# EAGLE design decoder_bard (EAGLE 9.3.2)
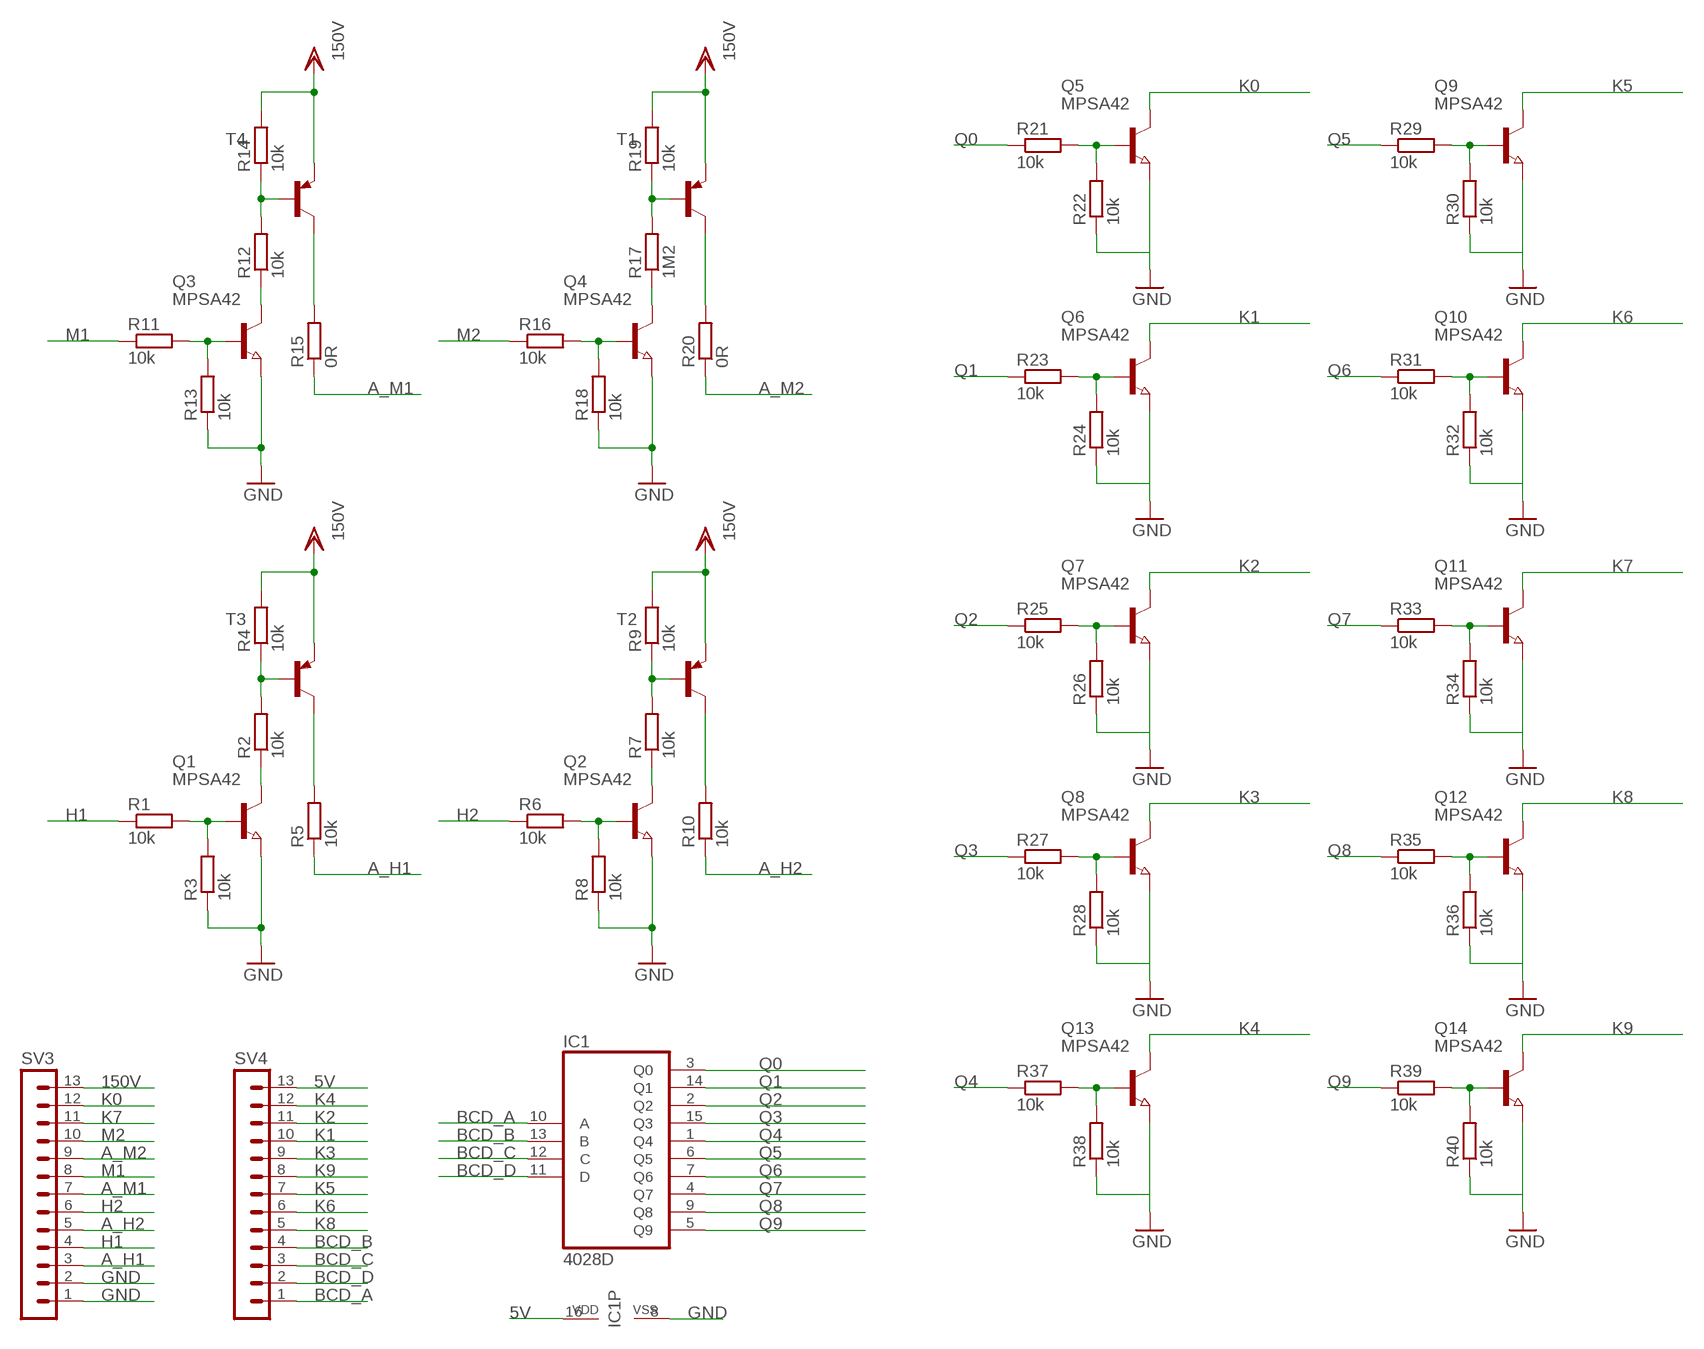
[diagram p0: schematic, sheet 1]

## Parts
IC1  4028D  [SO16]
Q1  MPSA42  NPN-TRANSISTOR_SOT23  [SOT23]
Q2  MPSA42  NPN-TRANSISTOR_SOT23  [SOT23]
Q3  MPSA42  NPN-TRANSISTOR_SOT23  [SOT23]
Q4  MPSA42  NPN-TRANSISTOR_SOT23  [SOT23]
Q5  MPSA42  NPN-TRANSISTOR_SOT23  [SOT23]
Q6  MPSA42  NPN-TRANSISTOR_SOT23  [SOT23]
Q7  MPSA42  NPN-TRANSISTOR_SOT23  [SOT23]
Q8  MPSA42  NPN-TRANSISTOR_SOT23  [SOT23]
Q9  MPSA42  NPN-TRANSISTOR_SOT23  [SOT23]
Q10  MPSA42  NPN-TRANSISTOR_SOT23  [SOT23]
Q11  MPSA42  NPN-TRANSISTOR_SOT23  [SOT23]
Q12  MPSA42  NPN-TRANSISTOR_SOT23  [SOT23]
Q13  MPSA42  NPN-TRANSISTOR_SOT23  [SOT23]
Q14  MPSA42  NPN-TRANSISTOR_SOT23  [SOT23]
R1  10k  R-EU_R1206  [R1206]
R2  10k  R-EU_R1206  [R1206]
R3  10k  R-EU_R1206  [R1206]
R4  10k  R-EU_R1206  [R1206]
R5  10k  R-EU_R1206  [R1206]
R6  10k  R-EU_R1206  [R1206]
R7  10k  R-EU_R1206  [R1206]
R8  10k  R-EU_R1206  [R1206]
R9  10k  R-EU_R1206  [R1206]
R10  10k  R-EU_R1206  [R1206]
R11  10k  R-EU_R1206  [R1206]
R12  10k  R-EU_R1206  [R1206]
R13  10k  R-EU_R1206  [R1206]
R14  10k  R-EU_R1206  [R1206]
R15  0R  R-EU_R1206  [R1206]
R16  10k  R-EU_R1206  [R1206]
R17  1M2  R-EU_R1206  [R1206]
R18  10k  R-EU_R1206  [R1206]
R19  10k  R-EU_R1206  [R1206]
R20  0R  R-EU_R1206  [R1206]
R21  10k  R-EU_R1206  [R1206]
R22  10k  R-EU_R1206  [R1206]
R23  10k  R-EU_R1206  [R1206]
R24  10k  R-EU_R1206  [R1206]
R25  10k  R-EU_R1206  [R1206]
R26  10k  R-EU_R1206  [R1206]
R27  10k  R-EU_R1206  [R1206]
R28  10k  R-EU_R1206  [R1206]
R29  10k  R-EU_R1206  [R1206]
R30  10k  R-EU_R1206  [R1206]
R31  10k  R-EU_R1206  [R1206]
R32  10k  R-EU_R1206  [R1206]
R33  10k  R-EU_R1206  [R1206]
R34  10k  R-EU_R1206  [R1206]
R35  10k  R-EU_R1206  [R1206]
R36  10k  R-EU_R1206  [R1206]
R37  10k  R-EU_R1206  [R1206]
R38  10k  R-EU_R1206  [R1206]
R39  10k  R-EU_R1206  [R1206]
R40  10k  R-EU_R1206  [R1206]
SV3  MA13-1  [MA13-1]
SV4  MA13-1  [MA13-1]
T1  MMBTA92LT1-PNP-SOT23-BEC  [SOT23-BEC]
T2  MMBTA92LT1-PNP-SOT23-BEC  [SOT23-BEC]
T3  MMBTA92LT1-PNP-SOT23-BEC  [SOT23-BEC]
T4  MMBTA92LT1-PNP-SOT23-BEC  [SOT23-BEC]

## Nets
5V: IC1.16(VDD) SV4.13
150V: R4.2 R9.2 R14.2 R19.2 SV3.13 T1.E T2.E T3.E T4.E
A_H1: R5.1 SV3.3
A_H2: R10.1 SV3.5
A_M1: R15.1 SV3.7
A_M2: R20.1 SV3.9
BCD_A: IC1.10(A) SV4.1
BCD_B: IC1.13(B) SV4.4
BCD_C: IC1.12(C) SV4.3
BCD_D: IC1.11(D) SV4.2
GND: IC1.8(VSS) Q1.2(E) Q2.2(E) Q3.2(E) Q4.2(E) Q5.2(E) Q6.2(E) Q7.2(E) Q8.2(E) Q9.2(E) Q10.2(E) Q11.2(E) Q12.2(E) Q13.2(E) Q14.2(E) R3.1 R8.1 R13.1 R18.1 R22.1 R24.1 R26.1 R28.1 R30.1 R32.1 R34.1 R36.1 R38.1 R40.1 SV3.1 SV3.2
H1: R1.1 SV3.4
H2: R6.1 SV3.6
K0: Q5.3(C) SV3.12
K1: Q6.3(C) SV4.10
K2: Q7.3(C) SV4.11
K3: Q8.3(C) SV4.9
K4: Q13.3(C) SV4.12
K5: Q9.3(C) SV4.7
K6: Q10.3(C) SV4.6
K7: Q11.3(C) SV3.11
K8: Q12.3(C) SV4.5
K9: Q14.3(C) SV4.8
M1: R11.1 SV3.8
M2: R16.1 SV3.10
N$2: Q1.1(B) R1.2 R3.2
N$4: Q1.3(C) R2.1
N$5: R5.2 T3.C
N$7: R2.2 R4.1 T3.B
N$8: Q2.1(B) R6.2 R8.2
N$9: Q2.3(C) R7.1
N$10: R10.2 T2.C
N$12: R7.2 R9.1 T2.B
N$14: Q3.1(B) R11.2 R13.2
N$15: Q3.3(C) R12.1
N$16: R15.2 T4.C
N$18: R12.2 R14.1 T4.B
N$20: Q4.1(B) R16.2 R18.2
N$21: Q4.3(C) R17.1
N$22: R20.2 T1.C
N$24: R17.2 R19.1 T1.B
N$25: Q5.1(B) R21.2 R22.2
N$28: Q6.1(B) R23.2 R24.2
N$31: Q7.1(B) R25.2 R26.2
N$34: Q8.1(B) R27.2 R28.2
N$37: Q9.1(B) R29.2 R30.2
N$40: Q10.1(B) R31.2 R32.2
N$43: Q11.1(B) R33.2 R34.2
N$46: Q12.1(B) R35.2 R36.2
N$49: Q13.1(B) R37.2 R38.2
N$52: Q14.1(B) R39.2 R40.2
Q0: IC1.3(Q0) R21.1
Q1: IC1.14(Q1) R23.1
Q2: IC1.2(Q2) R25.1
Q3: IC1.15(Q3) R27.1
Q4: IC1.1(Q4) R37.1
Q5: IC1.6(Q5) R29.1
Q6: IC1.7(Q6) R31.1
Q7: IC1.4(Q7) R33.1
Q8: IC1.9(Q8) R35.1
Q9: IC1.5(Q9) R39.1

## Library data of the parts
IC1 = 40xx:4028: BCD to decimal DECODER
Q1-Q14 = semicon-smd-ipc:NPN-TRANSISTOR_: NPN TRANSISTOR
R1-R40 = rcl:R-EU_: RESISTOR, European symbol; SPICEPREFIX: R
SV3 SV4 = con-lstb:MA13-1: PIN HEADER; OC_FARNELL: unknown; OC_NEWARK: unknown
T1-T4 = transistor:*-PNP-: PNP Transistror

## Board
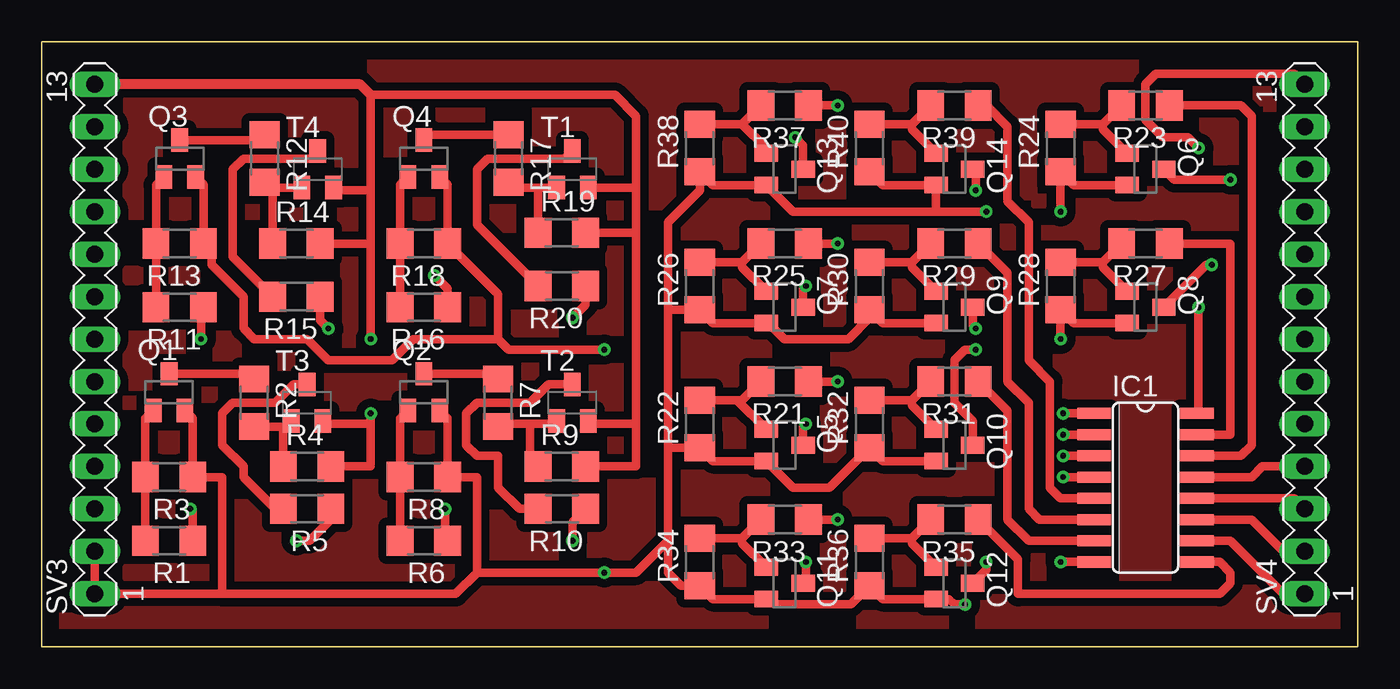
[diagram p1: board, top side]
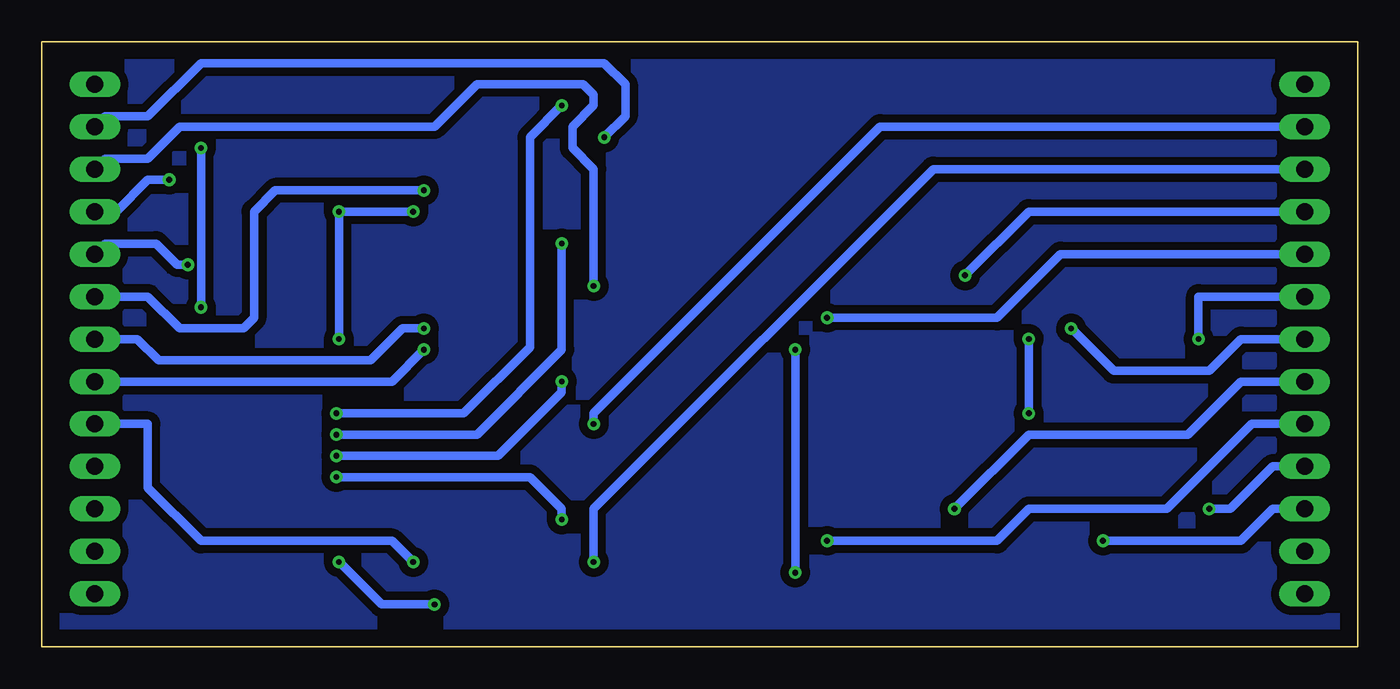
[diagram p2: board, bottom side, seen from below]

Size 78.74 x 36.2 mm. Coordinates in mm from the lower left corner, seen from the top.
Outline: 0,36.2 78.74,36.2 78.74,0 0,0 0,36.2
Copper layers (1*16): Top 0.035mm / dielectric 1.5mm / Bottom 0.035mm
Design rules "default": minimum track width 6mil, minimum drill 0.35mm, track to track 6mil, track to pad 6mil, pad to pad 6mil, via to via 6mil, smd to smd 6mil, copper to edge 40mil, drill to drill 6mil, minimum pad ring 10mil, minimum via ring 8mil, stop-mask expansion 4mil, vias tented up to drill 0mil, thermal gap 10mil

### Footprints (pad centres in the part's own frame; a part is rotated, then mirrored left to right if it is on the bottom)
SO16 = smd 0.66 x 2.032: 1 -4.445,-3.073; 2 -3.175,-3.073; 3 -1.905,-3.073; 4 -0.635,-3.073; 5 0.635,-3.073; 6 1.905,-3.073; 7 3.175,-3.073; 8 4.445,-3.073; 9 4.445,3.073; 10 3.175,3.073; 11 1.905,3.073; 12 0.635,3.073; 13 -0.635,3.073; 14 -1.905,3.073; 15 -3.175,3.073; 16 -4.445,3.073
SOT23 = smd 1 x 1.4: 1 -0.95,-1.1; 2 0.95,-1.1; 3 0,1.1
R1206 = smd 1.6 x 1.803: 1 -1.422,0; 2 1.422,0
MA13-1 = drill 1.016 long: 1 -15.24,0; 2 -12.7,0; 3 -10.16,0; 4 -7.62,0; 5 -5.08,0; 6 -2.54,0; 7 0,0; 8 2.54,0; 9 5.08,0; 10 7.62,0; 11 10.16,0; 12 12.7,0; 13 15.24,0
SOT23-BEC = smd 1 x 1.4: B -0.95,-1.1; C 0,1.1; E 0.95,-1.1

### Placement (x,y rotation side)
IC1  66.04,9.53 270 top
Q1  7.62,15.24 0 top
Q2  22.86,15.24 0 top
Q3  8.26,29.21 0 top
Q4  22.86,29.21 0 top
Q5  44.45,12.06 270 top
Q6  66.04,28.57 270 top
Q7  44.45,20.32 270 top
Q8  66.04,20.32 270 top
Q9  54.61,20.32 270 top
Q10  54.61,12.06 270 top
Q11  44.45,3.81 270 top
Q12  54.61,3.81 270 top
Q13  44.45,28.57 270 top
Q14  54.61,28.57 270 top
R1  7.62,6.35 180 top
R2  12.7,14.61 270 top
R3  7.62,10.16 180 top
R4  15.88,10.79 0 top
R5  15.88,8.26 180 top
R6  22.86,6.35 180 top
R7  27.3,14.61 270 top
R8  22.86,10.16 180 top
R9  31.11,10.79 0 top
R10  31.11,8.26 180 top
R11  8.26,20.32 180 top
R12  13.34,29.21 270 top
R13  8.26,24.13 180 top
R14  15.24,24.13 0 top
R15  15.24,20.95 180 top
R16  22.86,20.32 180 top
R17  27.94,29.21 270 top
R18  22.86,24.13 180 top
R19  31.11,24.77 0 top
R20  31.11,21.59 180 top
R21  44.45,15.88 180 top
R22  39.37,13.34 90 top
R23  66.04,32.38 180 top
R24  60.96,29.84 90 top
R25  44.45,24.13 180 top
R26  39.37,21.59 90 top
R27  66.04,24.13 180 top
R28  60.96,21.59 90 top
R29  54.61,24.13 180 top
R30  49.53,21.59 90 top
R31  54.61,15.88 180 top
R32  49.53,13.34 90 top
R33  44.45,7.62 180 top
R34  39.37,5.08 90 top
R35  54.61,7.62 180 top
R36  49.53,5.08 90 top
R37  44.45,32.38 180 top
R38  39.37,29.84 90 top
R39  54.61,32.38 180 top
R40  49.53,29.84 90 top
SV3  3.17,18.41 90 top
SV4  75.56,18.41 90 top
T1  31.75,28.57 0 top
T2  31.75,14.61 0 top
T3  15.88,14.61 0 top
T4  16.51,28.57 0 top

### Tracks (layer width: path | path; a pad name or v marks a point on that pad's centre or on a via)
5V  (via drill 0.35)
  Top 0.508: v69.22,20.32 69.22,14.07 IC1.16 | v69.22,29.84 68.58,30.48 67.09,30.48 66.04,31.53 66.04,33.66 66.67,34.29 74.93,34.29 SV4.13
  Bottom 0.508: v69.22,20.32 v69.22,29.84
150V  (via drill 0.35)
  Top 0.508: 19.68,27.3 19.68,33.02 34.29,33.02 35.56,31.75 35.56,27.3 | 19.68,27.3 19.68,24.13 | 19.68,13.34 19.68,10.79 R4.2 | 35.56,27.3 35.56,24.77 | 35.56,24.77 35.56,13.34 | 35.56,13.34 35.56,10.79 R9.2 | R14.2 19.68,24.13 | T4.E 17.63,27.3 19.68,27.3 | T1.E 35.39,27.48 35.56,27.3 | R19.2 35.56,24.77 | T2.E 32.87,13.34 35.56,13.34 | T3.E 17,13.34 19.68,13.34 | 19.68,24.13 v19.68,18.41 | v19.68,13.97 19.68,13.34
  Top 0.61: SV3.13 19.05,33.66 19.68,33.02
  Bottom 0.508: v19.68,18.41 v19.68,13.97
A_H1  (via drill 0.35)
  Top 0.508: v15.24,6.35 16.03,6.35 17.3,7.62 R5.1
  Bottom 0.508: v15.24,6.35 6.99,6.35 5.08,8.26 SV3.3
A_H2  (via drill 0.35)
  Top 0.508: v31.75,6.35 31.75,7.47 R10.1
  Bottom 0.508: v31.75,6.35 21.59,6.35 19.68,8.26 11.43,8.26 6.35,13.34 SV3.5
A_M1  (via drill 0.35)
  Top 0.508: v17.14,19.05 16.66,19.53 R15.1
  Bottom 0.508: v17.14,19.05 14.61,16.51 8.89,16.51 6.99,18.41 SV3.7
A_M2  (via drill 0.35)
  Top 0.508: v31.75,19.68 32.54,20.47 R20.1
  Bottom 0.508: SV3.9 17.78,23.5 21.59,19.68 v31.75,19.68
BCD_A
  Top 0.508: IC1.10 71.12,6.35 74.3,3.17 SV4.1
BCD_B
  Top 0.508: IC1.13 72.39,10.16 73.03,10.79 SV4.4
BCD_C
  Top 0.508: IC1.12 74.93,8.89 SV4.3
BCD_D
  Top 0.508: IC1.11 72.39,7.62 74.3,5.71 SV4.2
GND  (via drill 0.35)
  Top 0.508: Q1.2 9.04,13.67 R3.1 10.79,10.16 10.79,3.17 | Q2.2 24.28,13.67 R8.1 26.04,10.16 26.04,4.45 | R40.1 50.33,27.62 Q14.2 53.51,26.2 53.34,26.04 | Q9.2 50.33,19.37 R30.1 49.53,19.68 48.26,18.41 44.45,18.41 43.49,19.37 Q7.2 40.17,19.37 R26.1 37.47,20.17 | Q8.2 61.76,19.37 R28.1 v60.96,18.41 | Q6.2 61.76,27.62 R24.1 v60.96,26.04 | Q10.2 50.33,11.12 R32.1 47.14,9.53 44.94,9.53 Q5.2 40.17,11.12 R22.1 37.47,11.91 | 10.79,3.17 SV3.1 SV3.2 | 10.79,3.17 24.77,3.17 26.04,4.45 | 53.34,26.04 44.94,26.04 Q13.2 40.17,27.62 R38.1 39.37,27.3 37.47,25.4 37.47,20.17 | 53.34,26.04 v56.52,26.04 | 37.47,11.91 37.47,6.35 | 37.47,6.35 37.47,4.45 38.25,3.66 R34.1 40.17,2.86 Q11.2 43.49,2.86 43.81,2.54 48.41,2.54 R36.1 50.33,2.86 Q12.2 54.29,2.86 54.61,2.54 v55.24,2.54 | 37.47,20.17 37.47,11.91 | 26.04,4.45 v33.66,4.45 35.56,4.45 37.47,6.35 | v60.96,5.08 IC1.8 | Q4.2 24.28,27.64 R18.1 27.3,21.11 27.3,18.41 | Q3.2 9.68,27.64 R13.1 10.16,23.65 10.16,22.86 12.06,20.95 12.06,19.05 12.7,18.41 15.88,18.41 17.14,17.14 20.95,17.14 22.23,18.41 27.3,18.41 | 27.3,18.41 27.94,17.78 v33.66,17.78
  Bottom 0.508: v56.52,26.04 v60.96,26.04 v60.96,18.41 | v55.24,2.54 58.42,2.54 v60.96,5.08 | v33.66,17.78 v33.66,4.45
H1  (via drill 0.35)
  Top 0.508: v8.89,8.26 9.04,8.1 R1.1
  Bottom 0.508: SV3.4 5.08,10.79 7.62,8.26 v8.89,8.26
H2  (via drill 0.35)
  Top 0.508: v24.13,8.26 24.13,6.5 R6.1
  Bottom 0.508: v24.13,8.26 19.68,12.7 10.16,12.7 6.99,15.88 SV3.6
K0  (via drill 0.35)
  Top 0.508: Q5.3 45.55,13.16 v45.72,13.34
  Bottom 0.508: SV3.12 28.57,31.11 45.72,13.97 v45.72,13.34
K1  (via drill 0.35)
  Top 0.508: Q6.3 67.78,27.94 v71.12,27.94
  Bottom 0.508: v71.12,27.94 72.39,27.94 74.3,26.04 SV4.10
K2  (via drill 0.35)
  Top 0.508: v45.72,21.59 45.55,21.42 Q7.3
  Bottom 0.508: v45.72,21.59 45.72,28.57 46.99,29.84 46.99,31.11 45.72,32.38 45.72,33.02 46.35,33.66 52.7,33.66 55.24,31.11 70.48,31.11 72.39,29.21 74.93,29.21 SV4.11
K3  (via drill 0.35)
  Top 0.508: v70,22.86 69.68,22.86 Q8.3
  Bottom 0.508: v70,22.86 70.64,22.86 71.91,24.13 74.93,24.13 SV4.9
K4  (via drill 0.35)
  Top 0.508: Q13.3 45.55,30.02 v45.09,30.48
  Bottom 0.508: SV4.12 74.93,31.75 72.39,31.75 69.22,34.92 45.09,34.92 43.81,33.66 43.81,31.75 v45.09,30.48
K5  (via drill 0.35)
  Top 0.508: Q9.3 55.71,19.22 v55.88,19.05
  Bottom 0.508: SV4.7 73.03,18.41 71.75,17.14 59.05,17.14 57.15,19.05 v55.88,19.05
K6  (via drill 0.35)
  Top 0.508: Q10.3 55.71,13.51 54.61,14.61 54.61,17.14 55.24,17.78 v55.88,17.78
  Bottom 0.508: v55.88,17.78 57.78,15.88 SV4.6
K7  (via drill 0.35)
  Top 0.508: Q11.3 45.72,3.98 v45.72,5.08
  Bottom 0.508: SV3.11 25.4,28.57 45.72,8.26 v45.72,5.08
K8  (via drill 0.35)
  Top 0.508: Q12.3 56.52,4.62 v56.52,5.08
  Bottom 0.508: v56.52,5.08 57.78,6.35 69.22,6.35 72.39,9.53 72.39,13.34 SV4.5
K9  (via drill 0.35)
  Top 0.508: Q14.3 55.88,28.41 v55.88,27.3
  Bottom 0.508: v55.88,27.3 64.77,27.3 66.04,26.04 66.04,19.68 66.67,19.05 70.48,19.05 72.39,20.95 SV4.8
M1  (via drill 0.35)
  Top 0.508: v9.53,18.41 9.53,20.17 R11.1
  Bottom 0.508: v9.53,18.41 9.53,20.95 SV3.8
M2  (via drill 0.35)
  Top 0.508: v23.5,22.23 24.28,21.44 R16.1
  Bottom 0.508: v23.5,22.23 19.68,26.04 SV3.10
N$1
  pour Top (isolate 0.5): 0,0 78.74,0 78.74,36.2 0,36.2
N$2
  Top 0.508: Q1.1 6.2,13.67 R3.2 R1.2
N$4
  Top 0.508: Q1.3 12.39,16.34 R2.1
N$5
  Top 0.508: R5.2 13.97,8.26 12.06,10.16 12.06,10.79 10.79,12.06 10.79,13.97 11.43,14.61 13.97,14.61 15.07,15.71 T3.C
N$6
  pour Bottom (isolate 0.5): 0,0 78.74,0 78.74,36.2 0,36.2
N$7
  Top 0.508: R4.1 14.45,13.03 | 14.45,13.03 T3.B | R2.2 14.3,13.18 14.45,13.03
N$8
  Top 0.508: Q2.1 21.44,13.67 R8.2 R6.2
N$9
  Top 0.508: Q2.3 26.99,16.34 R7.1
N$10
  Top 0.508: T2.C 30.31,15.71 29.21,14.61 26.04,14.61 25.4,13.97 25.4,12.06 26.04,11.43 27.3,11.43 27.3,9.53 28.57,8.26 R10.2
N$12
  Top 0.508: R9.1 29.21,11.28 29.21,13.34 | 29.21,13.34 27.46,13.34 R7.2 | 29.21,13.34 30.63,13.34 T2.B
N$14
  Top 0.508: Q3.1 6.83,27.64 R13.2 R11.2
N$15
  Top 0.508: Q3.3 13.01,30.31 R12.1
N$16
  Top 0.508: R15.2 11.43,23.34 11.43,28.57 12.06,29.21 16.05,29.21 T4.C
N$18
  Top 0.508: R14.1 13.82,27.3 | 13.82,27.3 R12.2 | T4.B 13.99,27.48 13.82,27.3
N$20
  Top 0.508: R16.2 R18.2 21.44,27.64 Q4.1
N$21
  Top 0.508: Q4.3 23.18,30.63 R17.1
N$22
  Top 0.508: R20.2 26.04,25.25 26.04,28.57 26.67,29.21 31.29,29.21 T1.C
N$24
  Top 0.508: T1.B 29.84,27.48 | 29.84,27.48 28.25,27.48 R17.2 | R19.1 29.69,27.32 29.84,27.48
N$25
  Top 0.508: R22.2 41.61,14.76 | 41.61,14.76 41.91,14.76 R21.2 | Q5.1 41.61,14.76
N$28
  Top 0.508: R24.2 63.5,31.27 | 63.5,31.27 R23.2 | Q6.1 63.5,30.96 63.5,31.27
N$31
  Top 0.508: R26.2 41.91,23.01 | 41.91,23.01 R25.2 | Q7.1 41.91,22.71 41.91,23.01
N$34
  Top 0.508: R28.2 63.5,23.01 | 63.5,23.01 R27.2 | Q8.1 63.5,22.71 63.5,23.01
N$37
  Top 0.508: R30.2 52.07,23.01 | 52.07,23.01 R29.2 | Q9.1 52.07,22.71 52.07,23.01
N$40
  Top 0.508: R32.2 52.07,14.76 | 52.07,14.76 R31.2 | Q10.1 52.07,14.46 52.07,14.76
N$43
  Top 0.508: R34.2 41.91,6.5 | 41.91,6.5 R33.2 | Q11.1 41.91,6.2 41.91,6.5
N$46
  Top 0.508: R36.2 52.07,6.5 | 52.07,6.5 R35.2 | Q12.1 52.07,6.2 52.07,6.5
N$49
  Top 0.508: R38.2 41.91,31.27 | 41.91,31.27 R37.2 | Q13.1 43.35,29.83 41.91,31.27
N$52
  Top 0.508: R40.2 52.07,31.27 | 52.07,31.27 R39.2 | Q14.1 52.07,30.96 52.07,31.27
Q0  (via drill 0.35)
  Top 0.508: IC1.3 v61.11,11.43 | v47.62,15.88 R21.1
  Bottom 0.508: v61.11,11.43 51.44,11.43 47.62,15.24 v47.62,15.88
Q1
  Top 0.508: IC1.14 71.75,11.43 72.39,12.06 72.39,31.75 71.75,32.38 R23.1
Q2  (via drill 0.35)
  Top 0.508: v47.62,24.13 R25.1 | IC1.2 v61.11,12.7
  Bottom 0.508: v47.62,24.13 47.62,17.78 52.7,12.7 v61.11,12.7
Q3
  Top 0.508: IC1.15 71.12,12.7 71.12,24.13 R27.1
Q4  (via drill 0.35)
  Top 0.508: v47.62,32.38 R37.1 | IC1.1 v61.11,13.97
  Bottom 0.508: v61.11,13.97 53.49,13.97 49.53,17.93 49.53,30.48 v47.62,32.38
Q5
  Top 0.508: IC1.6 59.69,7.62 59.05,8.26 59.05,14.61 57.78,15.88 57.78,22.38 R29.1
Q6
  Top 0.508: IC1.7 59.05,6.35 57.78,7.62 57.78,14.12 R31.1
Q7  (via drill 0.35)
  Top 0.508: IC1.4 v61.11,10.16 | v47.62,7.62 R33.1
  Bottom 0.508: v61.11,10.16 49.53,10.16 47.62,8.26 v47.62,7.62
Q8
  Top 0.508: IC1.9 70.48,5.08 71.12,4.45 71.12,3.81 70.48,3.17 58.42,3.17 58.42,5.23 R35.1
Q9
  Top 0.508: IC1.5 60.96,8.89 60.33,9.53 60.33,15.88 59.05,17.14 59.05,25.4 57.78,26.67 57.78,31.11 56.52,32.38 R39.1